# Altium schematic sheet 12V_board.SchDoc
size A4
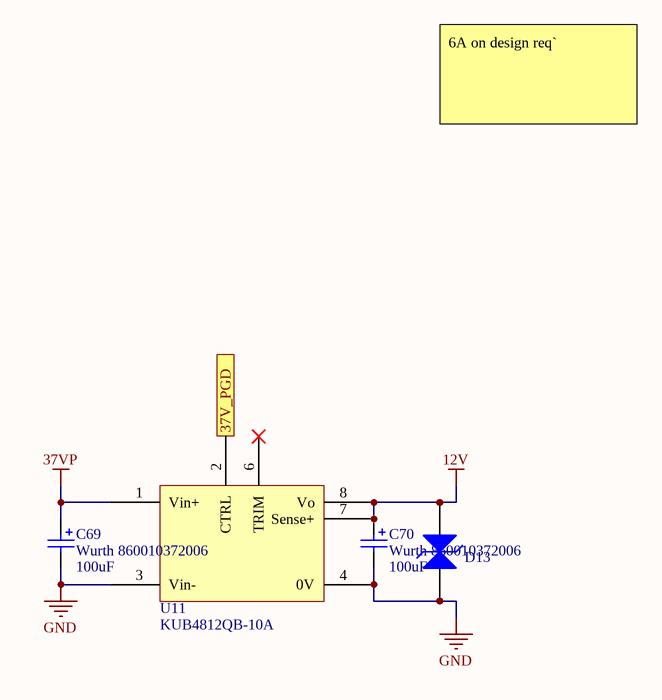
[diagram p0: 12V_board.SchDoc]

## Parts
C69  Wurth 860010372006  value 100uF  [Wurth 860010372006]
C70  Wurth 860010372006  value 100uF  [Wurth 860010372006]
D13  TVS_DIODE  [SMBJ54A-13-F]  (value not drawn)
U11  KUB4812QB-10A  [KUB48XXQB-10A]

## Ports
37V_PGD (in)

## Nets
12V: C70.1 D13.1(A) U11.7(Sense+) U11.8(Vo)
37VP: C69.1 U11.1(Vin+)
GND: C69.2 C70.2 D13.2(K) U11.3(Vin-) U11.4(0V)
37V_PGD: U11.2(CTRL) ; port 37V_PGD

Not connected (* = marked no-connect by the designer): U11 6(TRIM)*

## Notes on the sheet
- 6A on design req`

## Library data of the parts
C69 C70 = Wurth 860010372006: Polarized Capacitor (Radial)
D13 = TVS_DIODE: TVS Diode; Published: 8-Jun-2000; LatestRevisionDate: 17-Jul-2002; LatestRevisionNote: Re-released for DXP Platform.; PackageVersion: Sep-1996; PackageReference: SMC; Publisher: Altium Limited; PackageDescription: DO-214-AB/SMC; 2 C-Bend Leads; Body 7.9 x 5.9 mm, inc. leads (LxW); Code_JEDEC: DO-214-AB
U11 = KUB4812QB-10A: 12V 10A DC DC step down